# EAGLE design commUnit (EAGLE 6.5.0)
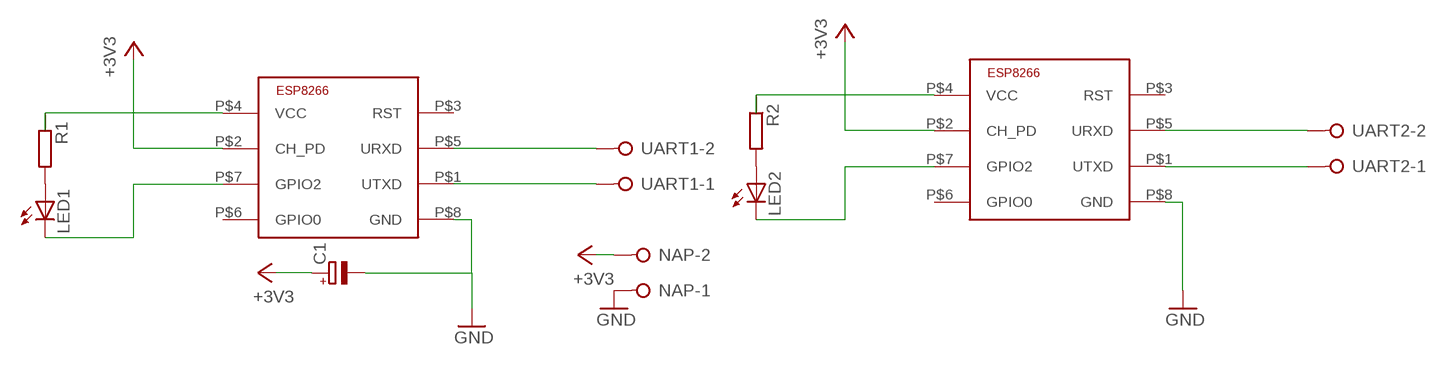
[diagram p0: schematic, sheet 1]

## Parts
C1  CPOL-EUE3.5-10  [E3,5-10]
LED1  LED3MM  [LED3MM]
LED2  LED3MM  [LED3MM]
NAP  W237-02P  [W237-132]
R1  R-EU_0207/10  [0207/10]
R2  R-EU_0207/10  [0207/10]
U$1  ESP8266-01  [ESP-01]
U$2  ESP8266-01  [ESP-01]
UART1  W237-02P  [W237-132]
UART2  W237-02P  [W237-132]

## Nets
+3V3: C1.+ NAP.2 R1.1 R2.1 U$1.P$2(CH_PD) U$1.P$4(VCC) U$2.P$2(CH_PD) U$2.P$4(VCC)
GND: C1.- NAP.1 U$1.P$8(GND) U$2.P$8(GND)
N$1: LED1.A R1.2
N$2: LED1.K(C) U$1.P$7(GPIO2)
N$3: U$1.P$5(URXD) UART1.2
N$4: U$1.P$1(UTXD) UART1.1
N$5: U$2.P$5(URXD) UART2.2
N$6: LED2.A R2.2
N$7: LED2.K(C) U$2.P$7(GPIO2)
N$8: U$2.P$1(UTXD) UART2.1
Unconnected: U$1.P$3(RST) U$1.P$6(GPIO0) U$2.P$3(RST) U$2.P$6(GPIO0)

## Library data of the parts
C1 = rcl:CPOL-EU: POLARIZED CAPACITOR, European symbol
LED1 LED2 = led:LED: LED OSRAM: - CHIPLED LG R971, LG N971, LY N971, LG Q971, LY Q971, LO R971, LY R971 LH N974, LH R974 LS Q976, LO Q976, LY Q976 LO Q996 - Hyper CHIPLED LW Q18S LB Q993, LB Q99A, LB R99A - SideLED LS A670, LO A670, LY A670, LG A670, LP A670 LB A673, LV A673, LT A673, LW A673 LH A674 LY A675 LS A676, LA A676, LO A676, LY A676, LW A676 LS A679, LY A679, LG A679 - Hyper Micro SIDELED® LS Y876, LA Y876, LO Y876, LY Y876 LT Y87S - SmartLED LW L88C, LW L88S LB L89C, LB L89S, LG L890 LS L89K, LO L89K, LY L89K LS L896, LA L896, LO L896, LY L896 - TOPLED LS T670, LO T670, LY T670, LG T670, LP T670 LSG T670, LSP T670, LSY T670, LOP T670, LYG T670 LG T671, LOG T671, LSG T671 LB T673, LV T673, LT T673, LW T673 LH T674 LS T676, LA T676, LO T676, LY T676, LB T676, LH T676, LSB T676, LW T676 LB T67C, LV T67C, LT T67C, LS T67K, LO T67K, LY T67K, LW E67C LS E67B, LA E67B, LO E67B, LY E67B, LB E67C, LV E67C, LT E67C LW T67C LS T679, LY T679, LG T679 LS T770, LO T770, LY T770, LG T770, LP T770 LB T773, LV T773, LT T773, LW T773 LH T774 LS E675, LA E675, LY E675, LS T675 LS T776, LA T776, LO T776, LY T776, LB T776 LHGB T686 LT T68C, LB T68C - Hyper Mini TOPLED® LB M676 - Mini TOPLED Santana® LG M470 LS M47K, LO M47K, LY M47K Source: http://www.osram.convergy.de LUXEON: - LUMILED® LXK2-PW12-R00, LXK2-PW12-S00, LXK2-PW14-U00, LXK2-PW14-V00 LXK2-PM12-R00, LXK2-PM12-S00, LXK2-PM14-U00 LXK2-PE12-Q00, LXK2-PE12-R00, LXK2-PE12-S00, LXK2-PE14-T00, LXK2-PE14-U00 LXK2-PB12-K00, LXK2-PB12-L00, LXK2-PB12-M00, LXK2-PB14-N00, LXK2-PB14-P00, LXK2-PB14-Q00 LXK2-PR12-L00, LXK2-PR12-M00, LXK2-PR14-Q00, LXK2-PR14-R00 LXK2-PD12-Q00, LXK2-PD12-R00, LXK2-PD12-S00 LXK2-PH12-R00, LXK2-PH12-S00 LXK2-PL12-P00, LXK2-PL12-Q00, LXK2-PL12-R00 Source: www.luxeon.com KINGBRIGHT: KA-3528ASYC Source: www.kingbright.com
NAP UART1 UART2 = con-wago-508:W237-02P: WAGO SREW CLAMP; OC_FARNELL: unknown; OC_NEWARK: unknown
R1 R2 = resistor:R-EU_: RESISTOR, European symbol
U$1 U$2 = ESP8266:ESP8266-01: ESP8266 - ESP-01 Module

## Board
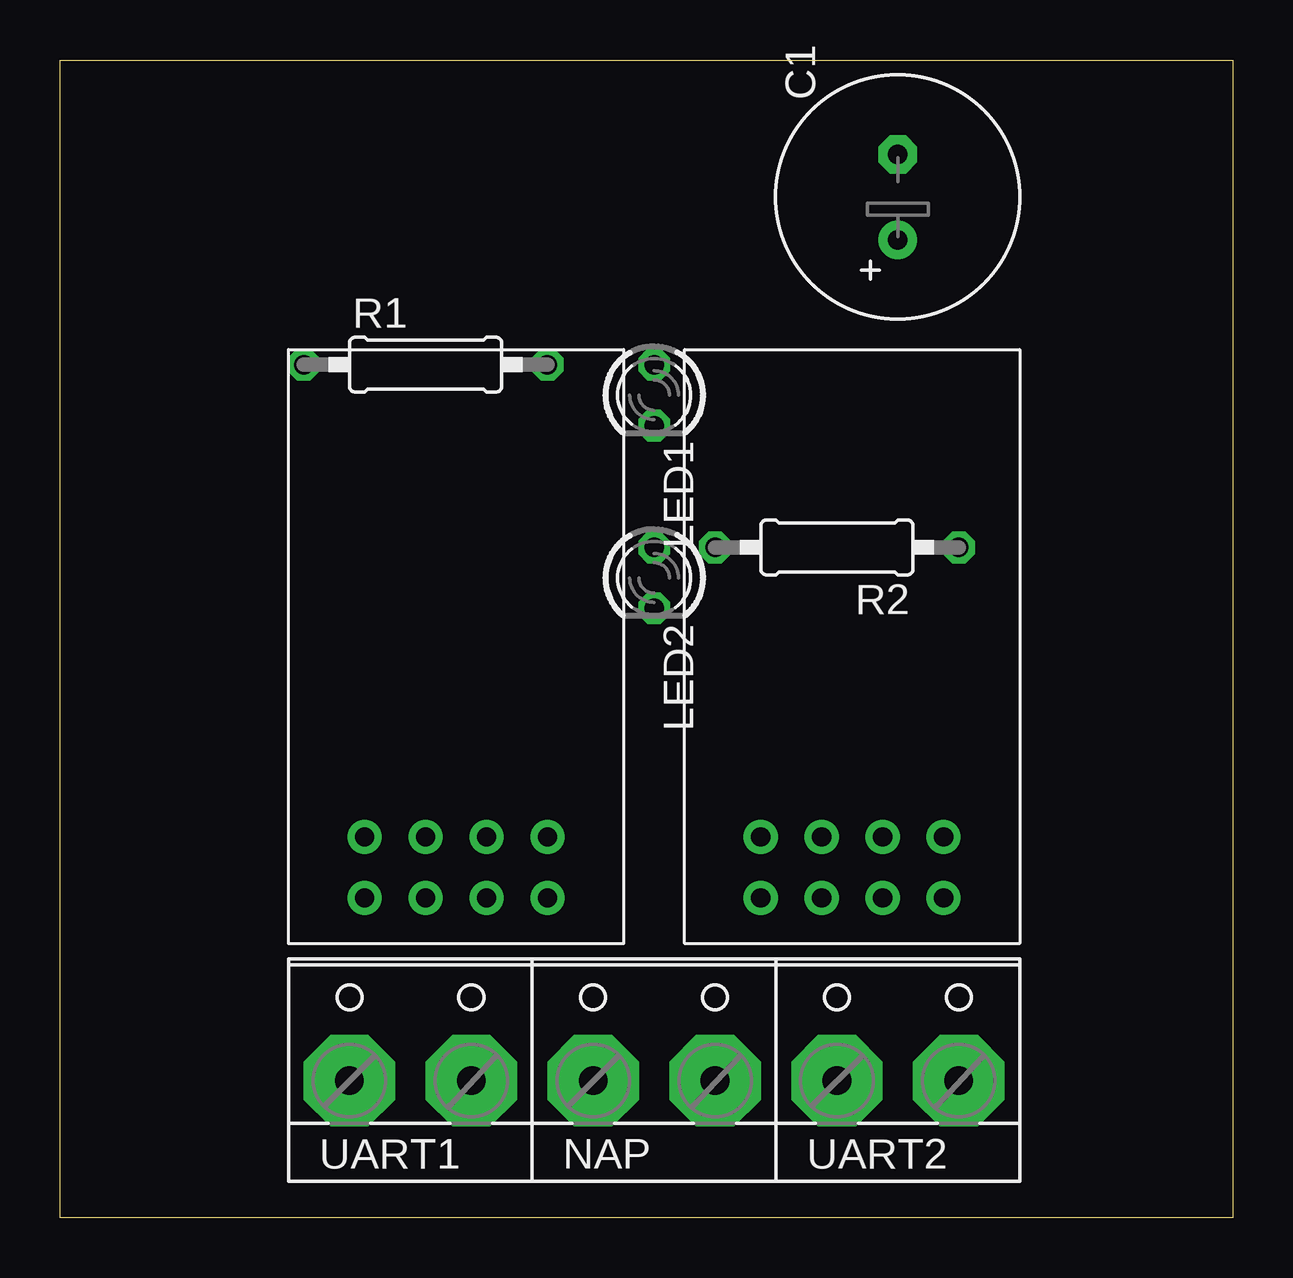
[diagram p1: board, top side]
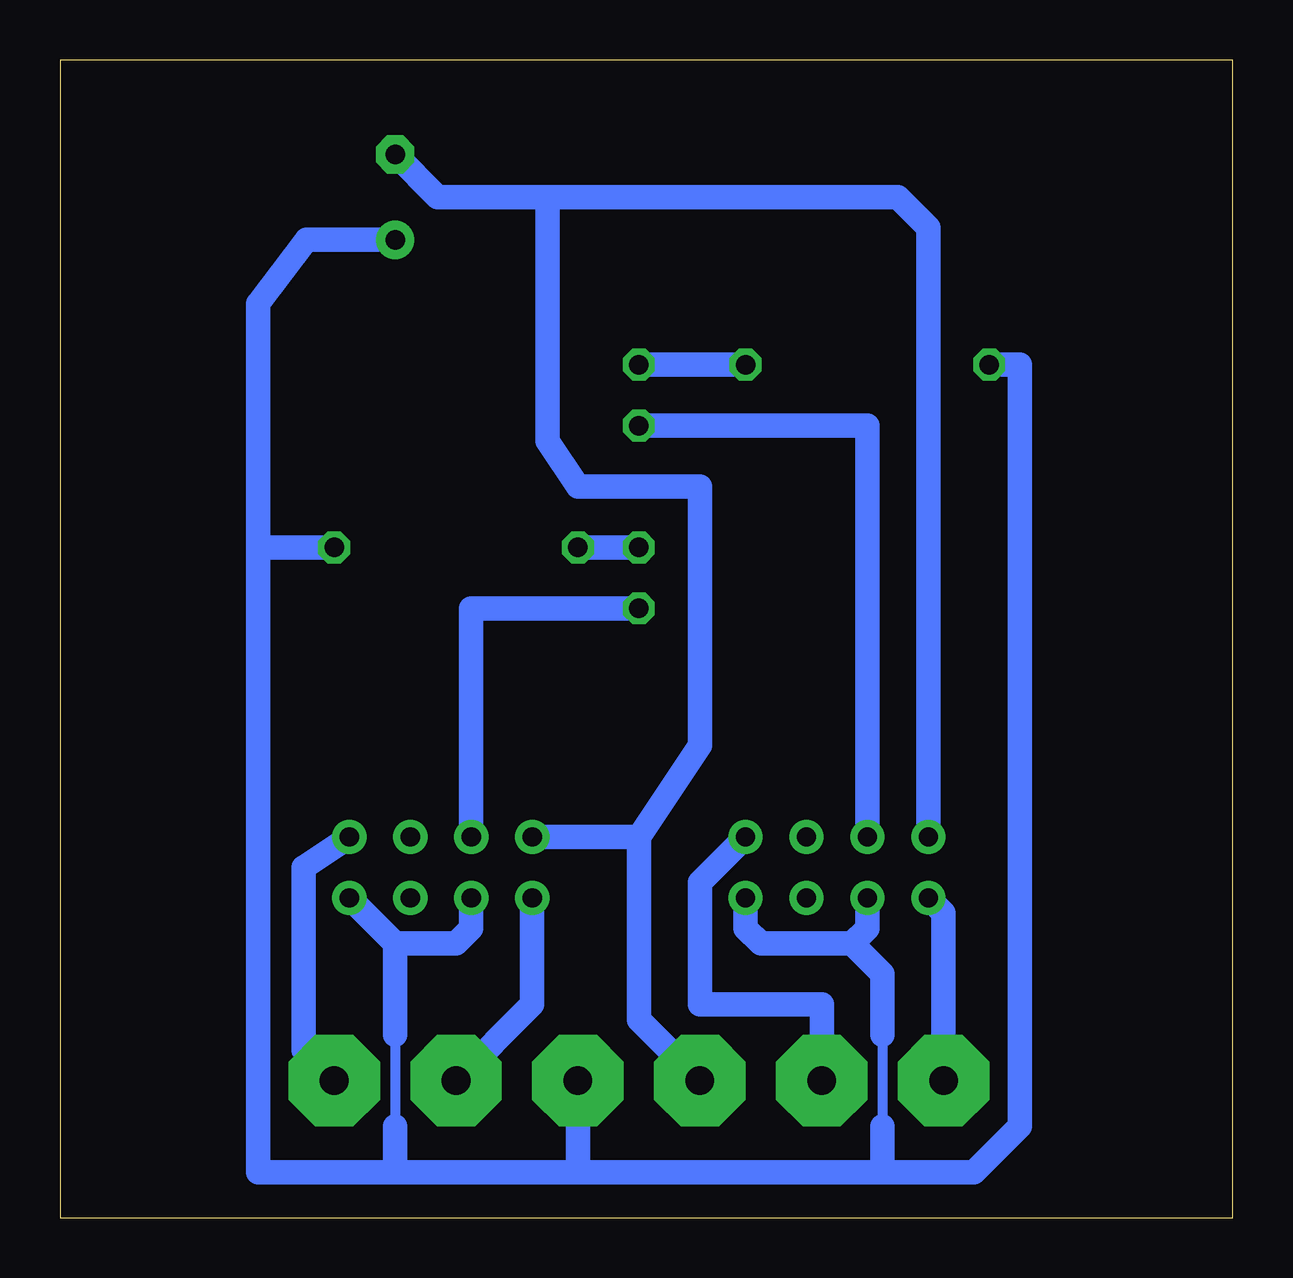
[diagram p2: board, bottom side, seen from below]

Size 48.89 x 48.26 mm. Coordinates in mm from the lower left corner, seen from the top.
Outline: 0,0 0,48.26 48.89,48.26 48.89,0 0,0
Copper layers (1*16): Top 0.035mm / dielectric 1.5mm / Bottom 0.035mm
Design rules "default": minimum track width 10mil, minimum drill 24mil, track to track 8mil, track to pad 8mil, pad to pad 8mil, via to via 8mil, smd to smd 8mil, copper to edge 40mil, drill to drill 8mil, minimum pad ring 10mil, minimum via ring 8mil, stop-mask expansion 4mil, vias tented up to drill 0mil, thermal gap 10mil

### Footprints (pad centres in the part's own frame; a part is rotated, then mirrored left to right if it is on the bottom)
E3,5-10 = drill 0.813 pad 1.6: + -1.778,0 | drill 0.813 pad 1.6 octagon: - 1.778,0
LED3MM = drill 0.813 octagon: A -1.27,0; K 1.27,0
W237-132 = drill 1.194 pad 3.81 octagon: 1 -2.54,-0.635; 2 2.54,-0.635
0207/10 = drill 0.813 octagon: 1 -5.08,0; 2 5.08,0
ESP-01 = drill 0.8 pad 1.422: P$1 0,0; P$2 2.54,0; P$3 5.08,0; P$4 7.62,0; P$5 7.62,2.54; P$6 5.08,2.54; P$7 2.54,2.54; P$8 0,2.54

### Placement (x,y rotation side)
C1  34.92,42.54 90 top
LED1  24.77,34.29 270 top
LED2  24.77,26.67 270 top
NAP  24.77,6.35 0 top
R1  15.24,35.56 0 top
R2  32.38,27.94 180 top
U$1  12.7,13.33 0 top
U$2  29.21,13.33 0 top
UART1  14.61,6.35 0 top
UART2  34.92,6.35 0 top

### Tracks (layer width: path | path; a pad name or v marks a point on that pad's centre or on a via)
+3V3
  Bottom 0.406: 34.92,7.62 34.92,3.81 | 14.61,7.62 14.61,3.81
  Bottom 1.016: U$2.P$2 31.75,12.06 32.38,11.43 34.92,11.43 | 34.92,11.43 U$2.P$4 | U$1.P$2 15.24,12.06 15.88,11.43 | U$1.P$4 20.32,12.06 19.69,11.43 15.88,11.43 | 14.61,1.91 10.79,1.91 8.89,3.81 8.89,35.56 R1.1 | 14.61,1.91 27.31,1.91 | 27.31,1.91 34.92,1.91 | 34.92,1.91 40.64,1.91 40.64,27.94 | R2.1 40.64,27.94 | NAP.2 27.31,1.91 | 34.92,11.43 34.92,7.62 | 34.92,3.81 34.92,1.91 | 15.88,11.43 14.61,10.16 14.61,7.62 | 14.61,3.81 14.61,1.91 | C1.+ 38.61,40.77 40.64,38.1 40.64,27.94
GND
  Bottom 1.016: 28.58,42.54 13.97,42.54 12.7,41.27 U$1.P$8 | 28.58,42.54 33.15,42.54 C1.- | NAP.1 24.77,8.26 24.77,15.88 | 24.77,15.88 U$2.P$8 | 24.77,15.88 22.23,19.69 22.23,30.48 27.31,30.48 28.58,32.38 28.58,42.54
N$1
  Bottom 1.016: R1.2 LED1.A
N$2
  Bottom 1.016: LED1.K 15.24,33.02 U$1.P$7
N$3
  Bottom 1.016: UART1.2 17.15,8.89 22.23,8.89 22.23,13.97 U$1.P$5
N$4
  Bottom 1.016: UART1.1 12.06,12.7 U$1.P$1
N$5
  Bottom 1.016: UART2.2 38.73,6.98 38.73,14.61 U$2.P$5
N$6
  Bottom 1.016: LED2.A R2.2
N$7
  Bottom 1.016: U$2.P$7 31.75,25.4 LED2.K
N$8
  Bottom 1.016: U$2.P$1 29.21,8.89 UART2.1